# Altium schematic sheet IHC.SchDoc
size A4; SheetNumber: 2; SheetTotal: 2
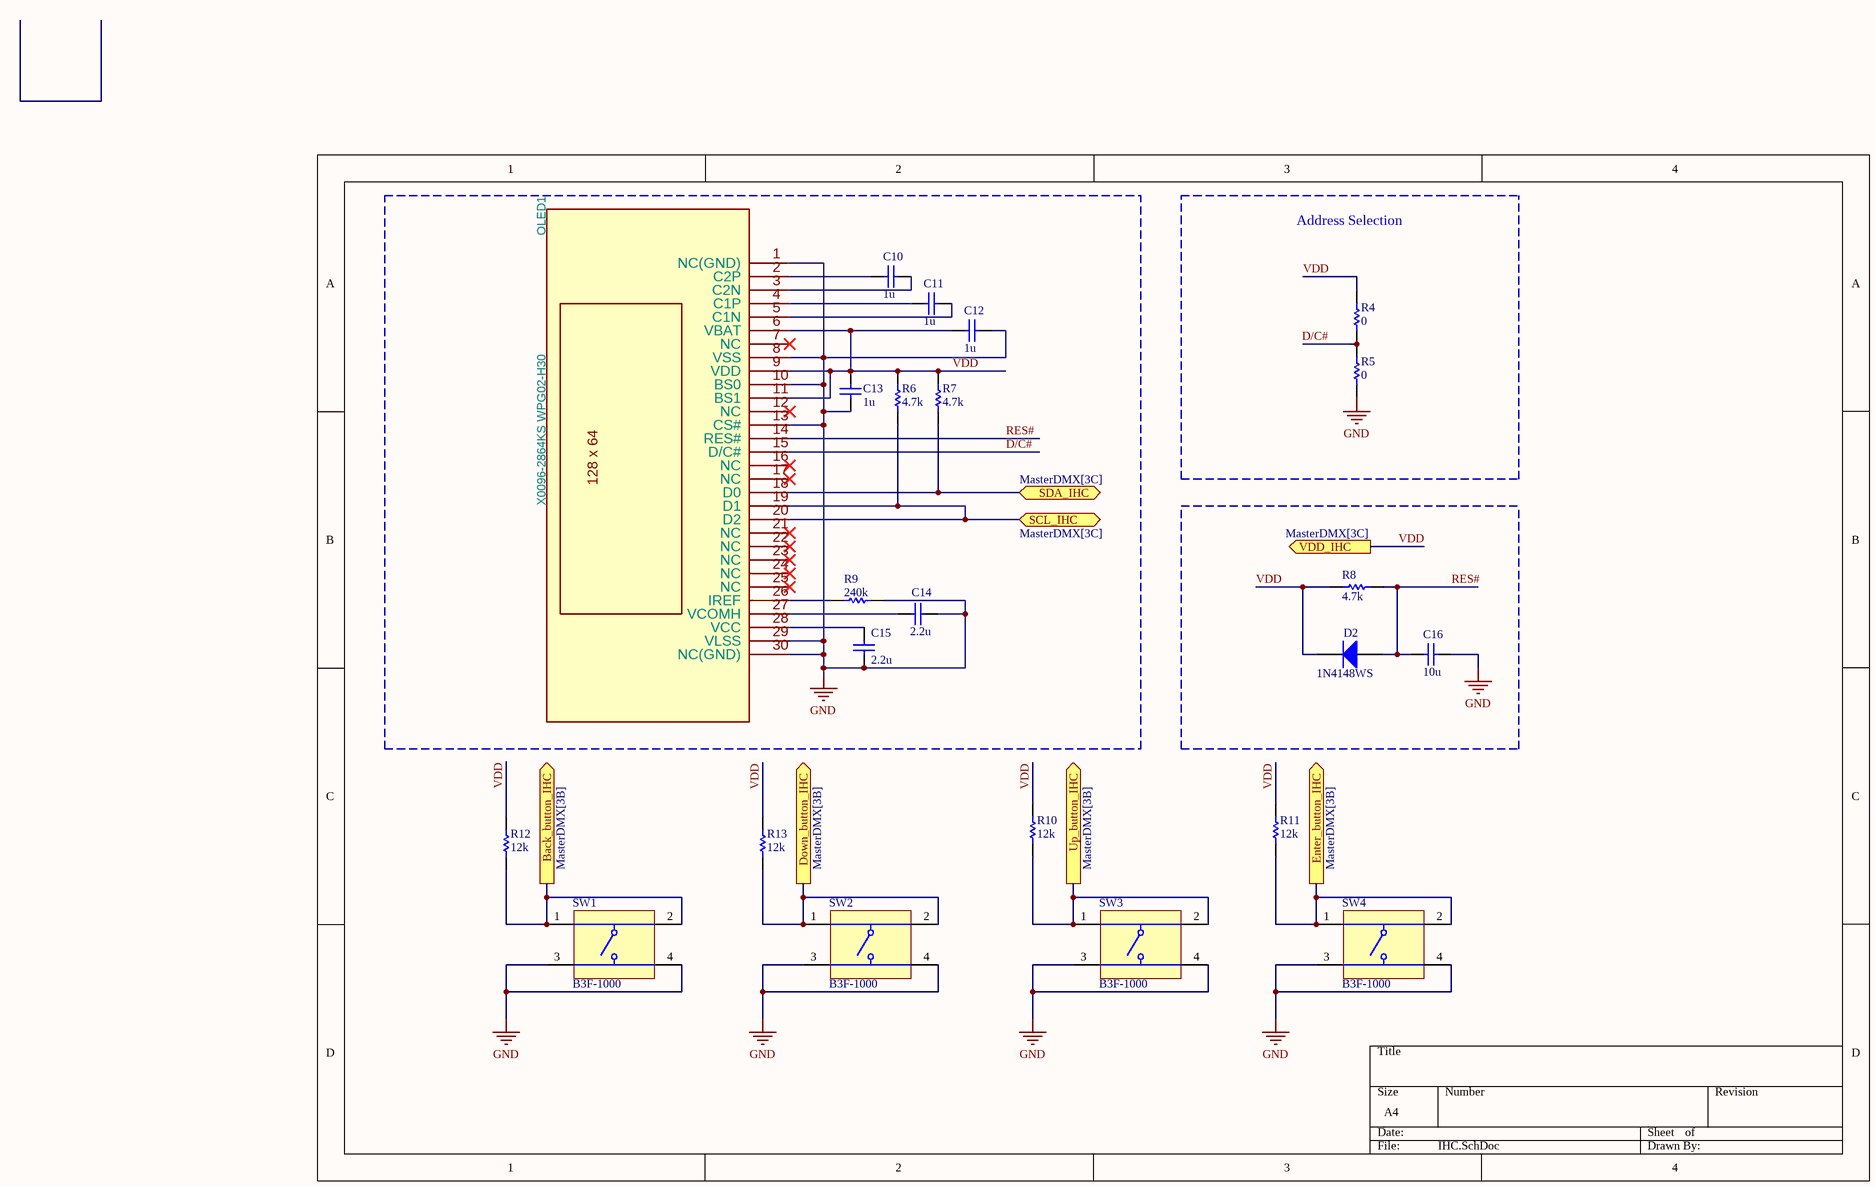
[diagram p0: IHC.SchDoc]

## Parts
C10  1u  [C2012[0805]]
C11  1u  [C2012[0805]]
C12  1u  [C2012[0805]]
C13  1u  [C2012[0805]]
C14  2.2u  [C2012[0805]]
C15  2.2u  [C2012[0805]]
C16  10u  [C2012[0805]]
D2  1N4148WS  [FAIR-SOD-323_V]
OLED1  X0096-2864KS WPG02-H30  [SSD1315_0.96in_30P]
R4  0  [R2012[0805]]
R5  0  [R2012[0805]]
R6  4.7k  [R2012[0805]]
R7  4.7k  [R2012[0805]]
R8  4.7k  [R2012[0805]]
R9  240k  [R2012[0805]]
R10  12k  [R2012[0805]]
R11  12k  [R2012[0805]]
R12  12k  [R2012[0805]]
R13  12k  [R2012[0805]]
SW1  B3F-1000  [OMRON-B3F-1000-4_V]
SW2  B3F-1000  [OMRON-B3F-1000-4_V]
SW3  B3F-1000  [OMRON-B3F-1000-4_V]
SW4  B3F-1000  [OMRON-B3F-1000-4_V]

## Blocks framed on the sheet
Address Selection: R4 R5

## Ports
Back_button_IHC (out, see MasterDMX[3B]), Down_button_IHC (out, see MasterDMX[3B]), Enter_button_IHC (out, see MasterDMX[3B]), SCL_IHC (bidir, see MasterDMX[3C]), SDA_IHC (bidir, see MasterDMX[3C]), Up_button_IHC (out, see MasterDMX[3B]), VDD_IHC (out, see MasterDMX[3C])

## Nets
GND: C12.1 C13.2 C14.1 C15.2 C16.1 OLED1.1(NC(GND)) OLED1.8(VSS) OLED1.10(BS0) OLED1.13(CS#) OLED1.29(VLSS) OLED1.30(NC(GND)) R5.1 R9.2 SW1.3 SW1.4 SW2.3 SW2.4 SW3.3 SW3.4 SW4.3 SW4.4
Back_button_IHC: R12.1 SW1.1 SW1.2 ; port Back_button_IHC
D/C#: OLED1.15(D/C#) R4.1 R5.2
Down_button_IHC: R13.1 SW2.1 SW2.2 ; port Down_button_IHC
Enter_button_IHC: R11.1 SW4.1 SW4.2 ; port Enter_button_IHC
RES#: C16.2 D2.1(A) OLED1.14(RES#) R8.1
SCL_IHC: OLED1.19(D1) OLED1.20(D2) R6.1 ; port SCL_IHC
SDA_IHC: OLED1.18(D0) R7.1 ; port SDA_IHC
Up_button_IHC: R10.1 SW3.1 SW3.2 ; port Up_button_IHC
VDD: C12.2 C13.1 D2.2(K) OLED1.6(VBAT) OLED1.9(VDD) OLED1.11(BS1) R4.2 R6.2 R7.2 R8.2 R10.2 R11.2 R12.2 R13.2 ; port VDD_IHC
NetC10_1: C10.1 OLED1.3(C2N)
NetC10_2: C10.2 OLED1.2(C2P)
NetC11_1: C11.1 OLED1.5(C1N)
NetC11_2: C11.2 OLED1.4(C1P)
NetC14_2: C14.2 OLED1.27(VCOMH)
NetC15_1: C15.1 OLED1.28(VCC)
NetOLED1_26: OLED1.26(IREF) R9.1

Not connected (* = marked no-connect by the designer): OLED1 7(NC)* 12(NC)* 16(NC)* 17(NC)* 21(NC)* 22(NC)* 23(NC)* 24(NC)* 25(NC)*

## Notes on the sheet
- (in symbol VG-2864KSWEG01-) 128 x 64

## Library data of the parts
C10-C16 = C: Capacitor; Value: 1; Manufacturer: *; PartNumber: *; Package Type: *
D2 = CMP-004-00001-2: Small Signal Diode, 75 V, 0.15 A, -55 to 150 degC, 2-Pin SOD-323, RoHS, Tape and Reel; Manufacturer: Fairchild; Recovery Time: 4ns; Forward Voltage: 1V; Peak Reverse Current: 5uA; Forward Current: 150mA; Capacitance: -323f; Datasheet URL: https://www.fairchildsemi.com/datasheets/1N/1N4148WS.pdf; Package Reference: SOD-323; Package Description: 2-Pin Small Outline Diode Flat Lead, Body 1.7 x 1.25 mm; Case/Package: SOD-323; Mounting Technology: SM; Manufacturer URL: https://www.fairchildsemi.com/; Pins: 2; Packaging: TapeandReel; Package Quantity: 3000; Min Operating Temperature: -55°C; RoHS Compliant: True; Max Operating Temperature: 150°C; Datasheet Version: Rev. 1.2, 03/2015
OLED1 = VG-2864KSWEG01-: Value: X0096-2864KS WPG02-H30; Footprint: PCB_display_Kicad:OLED 128X64
R4 R5 = R: Resistor; Manufacturer: *; PartNumber: *; Package Type: *; Value: 0
R6-R13 = R: Resistor; Value: 0; Manufacturer: *; PartNumber: *; Package Type: *
SW1-SW4 = CMP-011-00004-2: Tactile Switch, SPST-NO, 0.05 A, 24 V, -25 to 70 degC, 4-Pin THD, RoHS, Bulk; Manufacturer: Omron Electronic Components; Throw Configuration: SPST; Max Contact Resistance: 100mohm; Resistance: 0.1Ohm; Max Current Rating: 50mA; Voltage Rating: 24V; Operating Force: 100gf; Datasheet Version: Jan-15; Case/Package: B3F-1000; Packaging: Bulk; Package Description: 4-Pin Through Hole Device, Body 6 x 6 mm; Manufacturer URL: http://www.omron.com/; Package Reference: B3F-1000; Contact Plating: Gold; Contact Current Rating: 50mA; RoHS Compliant: True; Contact Material: Gold; Mounting Technology: TH; Max Operating Temperature: 70°C; Min Operating Temperature: -25°C; Package Quantity: 1500; Datasheet URL: http://www.omron.com/ecb/products/pdf/en-b3f.pdf; Voltage Rating (DC): 24V; Pins: 4; Current Rating: 50mA; Max Voltage Rating (DC): 24V